# Altium schematic sheet PSU.SchDoc: Power Supply
size A4; CompanyName: TM; DrawnBy: Juan Tinazzo; SheetNumber: 7; SheetTotal: 7; Number: CB_PSU
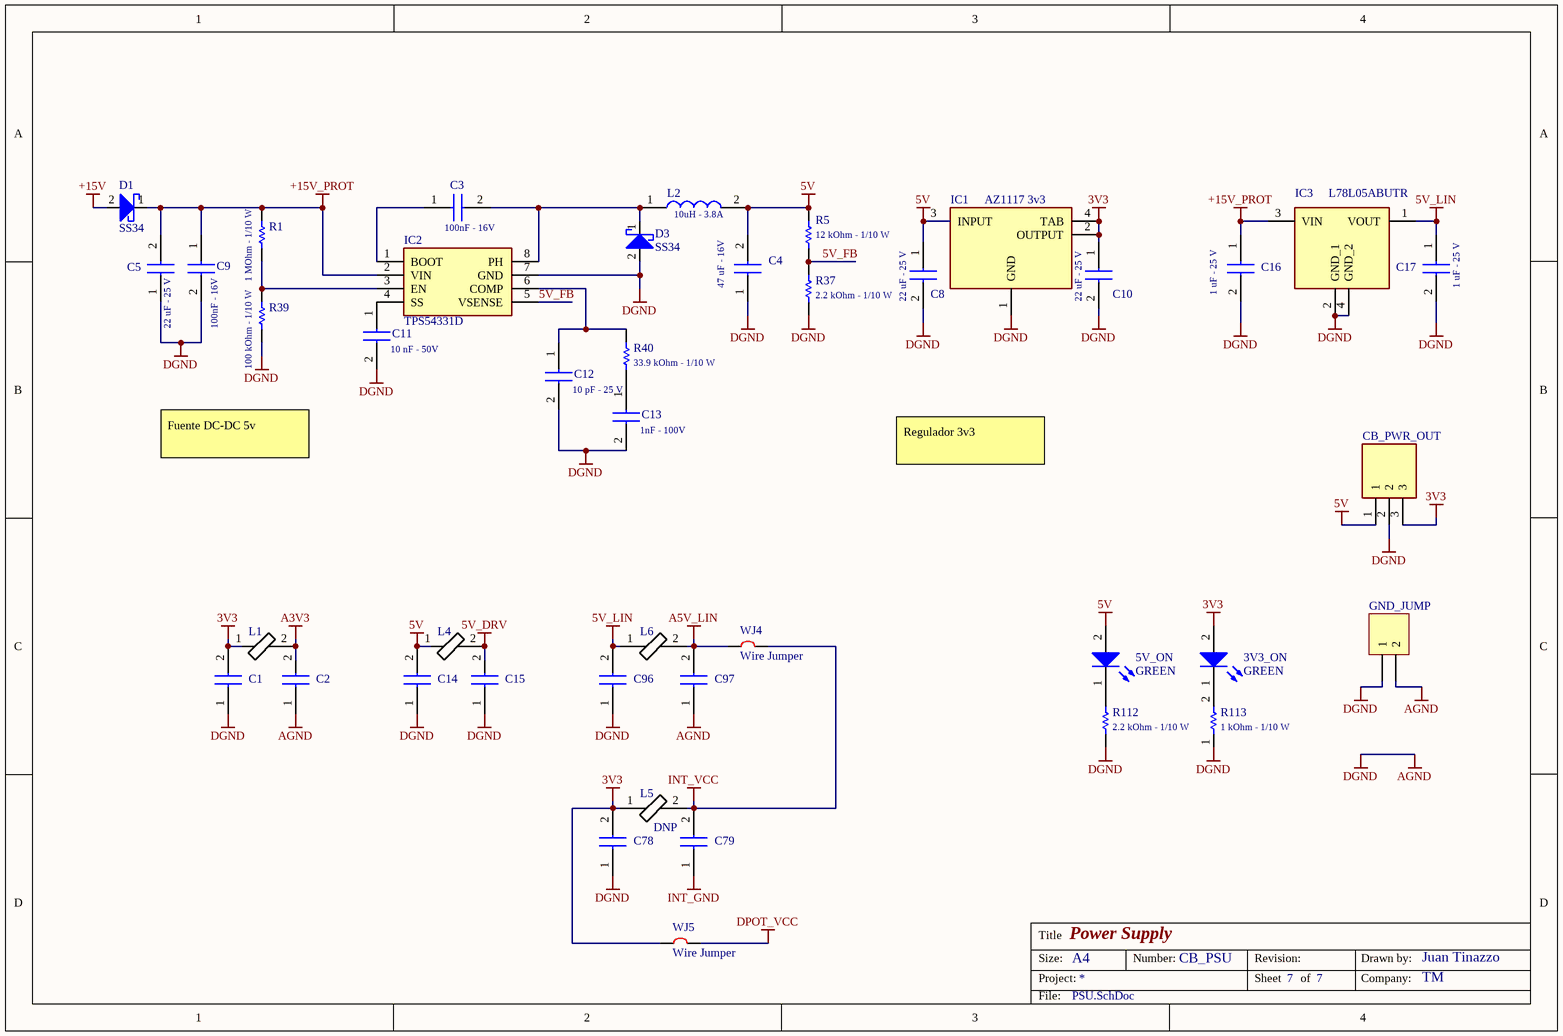
[diagram p0: PSU.SchDoc]

## Parts
3V3_ON  GREEN  [LEDC1608X80N]
5V_ON  GREEN  [LEDC1608X80N]
C1  CL21B105KAFNNNG  [CAPC2012X135N]  (value not drawn)
C2  CL21B105KAFNNNG  [CAPC2012X135N]  (value not drawn)
C3  value 100nF - 16V  [CAPC1608X95N]  (hidden comment: 100n 16V 0603)
C4  value 47 uF - 16V  [CAPC3225X270N]  (hidden comment: GRM32EC81C476KE15K)
C5  value 22 uF - 25 V  [CAPC3216X180N]  (hidden comment: CL31A226KAHNNNE)
C8  value 22 uF - 25 V  [CAPC3216X180N]  (hidden comment: CL31A226KAHNNNE)
C9  value 100nF - 16V  [CAPC1608X95N]  (hidden comment: 100n 16V 0603)
C10  value 22 uF - 25 V  [CAPC3216X180N]  (hidden comment: CL31A226KAHNNNE)
C11  value 10 nF - 50V  [CAPC1608X90N]  (hidden comment: CGA3E2X7R1H103K080AA)
C12  value 10 pF - 25 V  [CAPC1608X87N]  (hidden comment: C0603C100K3GACTU)
C13  value 1nF - 100V  [CAPC1608X90N]  (hidden comment: CGA3E2X7R2A102K080AA)
C14  CL21B105KAFNNNG  [CAPC2012X135N]  (value not drawn)
C15  CL21B105KAFNNNG  [CAPC2012X135N]  (value not drawn)
C16  value 1 uF - 25 V  [CAPC2012X135N]  (hidden comment: 1u)
C17  value 1 uF - 25 V  [CAPC2012X135N]  (hidden comment: 1u)
C78  CL21B105KAFNNNG  [CAPC2012X135N]  (value not drawn)
C79  CL21B105KAFNNNG  [CAPC2012X135N]  (value not drawn)
C96  CL21B105KAFNNNG  [CAPC2012X135N]  (value not drawn)
C97  CL21B105KAFNNNG  [CAPC2012X135N]  (value not drawn)
CB_PWR_OUT  76384-303LF  [76384303LF]  (value not drawn)
D1  SS34  [DIOM7959X262N]
D3  SS34  [DIOM7959X262N]
GND_JUMP  Header 2  [HDR1X2]  (value not drawn)
IC1  AZ1117 3v3  [SOT230P700X180-4N]
IC2  TPS54331D  [SOIC127P600X175-8N]
IC3  L78L05ABUTR  [L78L05ABUTR]
L1  78279220601  [BEADC2012X110N]  (value not drawn)
L2  value 10uH - 3.8A  [CDRH104RNP100NC]  (hidden comment: CDRH104RNP-100NC)
L4  78279220601  [BEADC2012X110N]  (value not drawn)
L5  DNP  [BEADC2012X110N]
L6  78279220601  [BEADC2012X110N]  (value not drawn)
R1  value 1 MOhm - 1/10 W  [RESC1608X50N]  (hidden comment: CRCW06031M00FKEA)
R5  value 12 kOhm - 1/10 W  [RESC1608X50N]  (hidden comment: CRCW060312K0FKEA)
R37  value 2.2 kOhm - 1/10 W  [RESC1608X50N]  (hidden comment: CRCW06032K20FKEA)
R39  value 100 kOhm - 1/10 W  [RESC1608X55N]  (hidden comment: CRCW0603100KFKEAC)
R40  value 33.9 kOhm - 1/10 W  [RESC1608X50N]  (hidden comment: CRCW060339K0FKEA)
R112  value 2.2 kOhm - 1/10 W  [RESC1608X50N]  (hidden comment: CRCW06032K20FKEA)
R113  value 1 kOhm - 1/10 W  [RESC1608X55N]  (hidden comment: CRCW06031K00FKEAC)
WJ4  Wire Jumper  (net tie, no BOM)
WJ5  Wire Jumper  (net tie, no BOM)

## Nets
3V3: 3V3_ON.2(A) C1.2 C10.1 C78.2 CB_PWR_OUT.3 IC1.2(OUTPUT) IC1.4(TAB) L1.1 L5.1 WJ5.0
5V: 5V_ON.2(A) C4.2 C8.1 C14.2 CB_PWR_OUT.1 IC1.3(INPUT) L2.2 L4.1 R5.2
5V_DRV: C15.2 L4.2
5V_LIN: C17.1 C96.2 IC3.1(VOUT) L6.1
+15V: D1.2(A)
+15V_PROT: C5.2 C9.1 C16.1 D1.1(K) IC2.2(VIN) IC3.3(VIN) R1.2
A3V3: C2.2 L1.2
A5V_LIN: C97.2 L6.2 WJ4.0
AGND: C1.1 C2.1 C4.1 C5.1 C8.2 C9.2 C10.2 C11.2 C12.2 C13.2 C14.1 C15.1 C16.2 C17.2 C78.1 C96.1 C97.1 CB_PWR_OUT.2 D3.2(A) GND_JUMP.1 GND_JUMP.2 IC1.1(GND) IC2.7(GND) IC3.2(GND_1) IC3.4(GND_2) R37.1 R39.1 R112.1 R113.1  [also labelled DGND]
DPOT_VCC: WJ5.1
INT_GND: C79.1
INT_VCC: C79.2 L5.2 WJ4.1
5V_FB: IC2.5(VSENSE) R5.1 R37.2
Net3V3_ON_1: 3V3_ON.1(K) R113.2
Net5V_ON_1: 5V_ON.1(K) R112.2
NetC3_1: C3.1 IC2.1(BOOT)
NetC3_2: C3.2 D3.1(K) IC2.8(PH) L2.1
NetC11_1: C11.1 IC2.4(SS)
NetC12_1: C12.1 IC2.6(COMP) R40.2
NetC13_1: C13.1 R40.1
NetIC2_3: IC2.3(EN) R1.1 R39.2

## Notes on the sheet
- Fuente DC-DC 5v
- Regulador 3v3
- Title
- Size:
- Project:
- A4
- Number:
- Revision:
- Sheet
- of
- Drawn by:
- Company:
- File:

## Library data of the parts
3V3_ON 5V_ON = 150060GS75000: LED; Manufacturer_Name: Wurth Elektronik; Value: Led Verde 0603; Datasheet Link: https://componentsearchengine.com/Datasheets/2/150060GS75000.pdf; Height: 0.8mm; Manufacturer_Part_Number: 150060GS75000; Mouser Part Number: 710-150060GS75000; Mouser Price/Stock: https://www.mouser.co.uk/ProductDetail/Wurth-Elektronik/150060GS75000?qs=LlUlMxKIyB0UYkq5lDO8nA%3D%3D
C1 C2 C14 C15 C78 C79 C96 C97 = CL21B105KAFNNNG: Capacitor; Manufacturer_Name: SAMSUNG; Value: 1 uF - 25 V; Datasheet Link: https://datasheet.datasheetarchive.com/originals/distributors/Datasheets-DGA8/2478773.pdf; Height: 1.35mm; Manufacturer_Part_Number: CL21B105KAFNNNG; Mouser Part Number: 187-CL21B105KAFNNNG; Mouser Price/Stock: https://www.mouser.co.uk/ProductDetail/Samsung-Electro-Mechanics/CL21B105KAFNNNG?qs=yOVawPpwOwmXkU%252BG0TK%2F5g%3D%3D; Arrow Part Number: CL21B105KAFNNNG; Arrow Price/Stock: https://www.arrow.com/en/products/cl21b105kafnnng/samsung-electro-mechanics?region=europe
C3 C9 = EMK107B7104KA-T: Capacitor; Manufacturer_Name: TAIYO YUDEN; Datasheet Link: http://www.farnell.com/datasheets/746258.pdf; Height: 0.95mm; Manufacturer_Part_Number: EMK107B7104KA-T; Mouser Part Number: 963-EMK107B7104KA-T; Mouser Price/Stock: https://www.mouser.co.uk/ProductDetail/Taiyo-Yuden/EMK107B7104KA-T?qs=I6KAKw0tg2ybqzX8hKPgfw%3D%3D; Arrow Part Number: EMK107B7104KA-T; Arrow Price/Stock: https://www.arrow.com/en/products/emk107b7104ka-t/taiyo-yuden
C4 = GRM32EC81C476KE15K: Capacitor; Manufacturer_Name: Murata Electronics; Datasheet Link: http://psearch.en.murata.com/capacitor/product/GRM32ER71E226KE15%23.pdf; Height: 2.7mm; Manufacturer_Part_Number: GRM32EC81C476KE15K; Mouser Part Number: 81-GRM32EC81C476KE5K; Mouser Price/Stock: https://www.mouser.co.uk/ProductDetail/Murata-Electronics/GRM32EC81C476KE15K?qs=pba5EUA0Y0ZfNhWUOosFbg%3D%3D; Arrow Part Number: GRM32EC81C476KE15K; Arrow Price/Stock: https://www.arrow.com/en/products/grm32ec81c476ke15k/murata-manufacturing?region=nac
C5 C8 C10 = CL31A226KAHNNNE: Capacitor; Manufacturer_Name: SAMSUNG; Datasheet Link: https://datasheet.datasheetarchive.com/originals/distributors/Datasheets_SAMA/9f57e07966b0fde480de744eca033cf5.pdf; Height: 1.8mm; Manufacturer_Part_Number: CL31A226KAHNNNE; Mouser Part Number: 187-CL31A226KAHNNNE; Mouser Price/Stock: https://www.mouser.co.uk/ProductDetail/Samsung-Electro-Mechanics/CL31A226KAHNNNE?qs=X6jEic%2FHinCdwsjGJII51w%3D%3D; Arrow Part Number: CL31A226KAHNNNE; Arrow Price/Stock: https://www.arrow.com/en/products/cl31a226kahnnne/samsung-electro-mechanics?region=europe
C11 = CGA3E2X7R1H103K080AA: Capacitor; Manufacturer_Name: TDK-Lambda; Datasheet Link: http://docs-europe.electrocomponents.com/webdocs/14e9/0900766b814e9125.pdf; Height: 0.9mm; Manufacturer_Part_Number: CGA3E2X7R1H103K080AA; Mouser Part Number: 810-CGA3E2X7R1H103K; Mouser Price/Stock: https://www.mouser.co.uk/ProductDetail/TDK/CGA3E2X7R1H103K080AA?qs=NRhsANhppD8MREuCb2mQKQ%3D%3D; Arrow Part Number: CGA3E2X7R1H103K080AA; Arrow Price/Stock: https://www.arrow.com/en/products/cga3e2x7r1h103k080aa/tdk?region=nac
C12 = C0603C100K3GACTU: Capacitor; Manufacturer_Name: KEMET; Datasheet Link: https://content.kemet.com/datasheets/KEM_C1003_C0G_SMD.pdf; Height: 0.87mm; Manufacturer_Part_Number: C0603C100K3GACTU; Mouser Part Number: 80-C0603C100K3G; Mouser Price/Stock: https://www.mouser.com/Search/Refine.aspx?Keyword=80-C0603C100K3G; Arrow Part Number: C0603C100K3GACTU; Arrow Price/Stock: https://www.arrow.com/en/products/c0603c100k3gactu/kemet-corporation
C13 = CGA3E2X7R2A102K080AA: Capacitor; Manufacturer_Name: TDK-Lambda; Datasheet Link: http://docs-europe.electrocomponents.com/webdocs/14e9/0900766b814e9125.pdf; Height: 0.9mm; Manufacturer_Part_Number: CGA3E2X7R2A102K080AA; Mouser Part Number: 810-CGA3E2X7R2A102K; Mouser Price/Stock: https://www.mouser.co.uk/ProductDetail/TDK/CGA3E2X7R2A102K080AA?qs=NRhsANhppD%2FkMFCdFnDSsQ%3D%3D; Arrow Part Number: CGA3E2X7R2A102K080AA; Arrow Price/Stock: https://www.arrow.com/en/products/cga3e2x7r2a102k080aa/tdk?region=nac
C16 C17 = CL21B105KAFNNNG: Capacitor; Manufacturer_Name: SAMSUNG; Datasheet Link: https://datasheet.datasheetarchive.com/originals/distributors/Datasheets-DGA8/2478773.pdf; Height: 1.35mm; Manufacturer_Part_Number: CL21B105KAFNNNG; Mouser Part Number: 187-CL21B105KAFNNNG; Mouser Price/Stock: https://www.mouser.co.uk/ProductDetail/Samsung-Electro-Mechanics/CL21B105KAFNNNG?qs=yOVawPpwOwmXkU%252BG0TK%2F5g%3D%3D; Arrow Part Number: CL21B105KAFNNNG; Arrow Price/Stock: https://www.arrow.com/en/products/cl21b105kafnnng/samsung-electro-mechanics?region=europe
CB_PWR_OUT = 76384-303LF: Connector; Manufacturer_Name: Amphenol Communications Solutions; Value: Alojamientos de cables y cabecera 3P VERT; Datasheet Link: https://cdn.amphenol-cs.com/media/wysiwyg/files/drawing/76384.pdf; Height: 9.49mm; Manufacturer_Part_Number: 76384-303LF; Mouser Part Number: 649-76384-303LF; System: Connector
D1 D3 = SS34: Schottky Diode; Manufacturer_Name: Taiwan Semiconductor; Value: 3A - 40V; Datasheet Link: https://componentsearchengine.com/Datasheets/1/SS34.pdf; Height: 2.62mm; Manufacturer_Part_Number: SS34; Mouser Part Number: 821-SS34; Mouser Price/Stock: https://www.mouser.co.uk/ProductDetail/Taiwan-Semiconductor/SS34?qs=JV7lzlMm3yIimVqgKV%2F1SA%3D%3D; Arrow Part Number: SS34; Arrow Price/Stock: https://www.arrow.com/en/products/ss34/taiwan-semiconductor?region=nac
GND_JUMP = Header 2: Header, 2-Pin; Manufacturer_Part_Number: Header 2.54 mm 2P; Value: Clip
IC1 = AZ1117CH-3.3TRG1: Integrated Circuit; Manufacturer_Name: Diodes Inc.; Value: Regulador Lineal 3.3 V; Datasheet Link: https://datasheet.datasheetarchive.com/originals/distributors/Datasheets-DGA25/1776204.pdf; Height: 1.8mm; Manufacturer_Part_Number: AZ1117CH-3.3TRG1; Mouser Part Number: 621-AZ1117CH-3.3TRG1; Mouser Price/Stock: https://www.mouser.co.uk/ProductDetail/Diodes-Incorporated/AZ1117CH-3.3TRG1?qs=FKu9oBikfSm7ntaG6olPSQ%3D%3D; Arrow Part Number: AZ1117CH-3.3TRG1; Arrow Price/Stock: https://www.arrow.com/en/products/az1117ch-3.3trg1/diodes-incorporated?region=nac
IC2 = TPS54331D: Integrated Circuit; Manufacturer_Name: Texas Instruments; Value: Reguladores de voltaje de conmutación 3A 28V In Step Down; Datasheet Link: http://www.ti.com/lit/gpn/tps54331; Height: 1.75mm; Manufacturer_Part_Number: TPS54331D; Mouser Part Number: 595-TPS54331D; Mouser Price/Stock: https://www.mouser.co.uk/ProductDetail/Texas-Instruments/TPS54331D?qs=QyYHynRG50pEbpiybdzwkw%3D%3D; Arrow Part Number: TPS54331D; Arrow Price/Stock: https://www.arrow.com/en/products/tps54331d/texas-instruments?region=nac
IC3 = L78L05ABUTR: Integrated Circuit; Manufacturer_Name: STMicroelectronics; Value: Reguladores de tensión lineal 5.0V 0.1A; Datasheet Link: https://componentsearchengine.com/Datasheets/2/L78L05ABUTR.pdf; Manufacturer_Part_Number: L78L05ABUTR; Mouser Part Number: 511-L78L05ABU; Mouser Price/Stock: https://www.mouser.co.uk/ProductDetail/STMicroelectronics/L78L05ABUTR?qs=1feNxqzJ94QQZYRl%252B78DYA%3D%3D; Arrow Part Number: L78L05ABUTR; Arrow Price/Stock: https://www.arrow.com/en/products/l78l05abutr/stmicroelectronics?region=europe
L1 L4-L6 = 78279220601: Ferrite Bead; Manufacturer_Name: Wurth Elektronik; Value: Núcleos de ferrita WE-MPSA EMI 600Ohms 2.1A 80mOhms; Datasheet Link: https://www.mouser.de/datasheet/2/445/78279220601-2298574.pdf; Height: 1.1mm; Manufacturer_Part_Number: 78279220601; Mouser Part Number: 710-78279220601; Mouser Price/Stock: https://www.mouser.co.uk/ProductDetail/Wurth-Elektronik/78279220601?qs=iLbezkQI%252BsjgiK1FovJqGg%3D%3D
L2 = CDRH104RNP-100NC: Inductor; Manufacturer_Name: Sumida; Datasheet Link: http://products.sumida.com/products/pdf/CDRH104R.pdf; Height: 4mm; Manufacturer_Part_Number: CDRH104RNP-100NC; Mouser Part Number: 851-CDRH104RNP-100NC; Mouser Price/Stock: https://www.mouser.co.uk/ProductDetail/Sumida/CDRH104RNP-100NC?qs=qsxNffVSAzE8lEZlJlwl9Q%3D%3D; Arrow Part Number: CDRH104RNP-100NC; Arrow Price/Stock: https://www.arrow.com/en/products/cdrh104rnp-100nc/sumida?region=nac
R1 = CRCW06031M00FKEA: Resistor; Manufacturer_Name: Vishay; Datasheet Link: http://www.vishay.com/docs/20035/dcrcwe3.pdf; Height: 0.5mm; Manufacturer_Part_Number: CRCW06031M00FKEA; Mouser Part Number: 71-CRCW0603-1.0M-E3; Mouser Price/Stock: https://www.mouser.co.uk/ProductDetail/Vishay-Dale/CRCW06031M00FKEA?qs=FqL7cmfwu%2FFSEaf7V3BJcQ%3D%3D; Arrow Part Number: CRCW06031M00FKEA; Arrow Price/Stock: https://www.arrow.com/en/products/crcw06031m00fkea/vishay?region=nac
R5 = CRCW060312K0FKEA: Resistor; Manufacturer_Name: Vishay; Datasheet Link: http://www.vishay.com/docs/20035/dcrcwe3.pdf; Height: 0.5mm; Manufacturer_Part_Number: CRCW060312K0FKEA; Mouser Part Number: 71-CRCW0603-12K-E3; Mouser Price/Stock: https://www.mouser.co.uk/ProductDetail/Vishay-Dale/CRCW060312K0FKEA?qs=HGDjLH0wsMDt1KMqI4fBYA%3D%3D; Arrow Part Number: CRCW060312K0FKEA; Arrow Price/Stock: https://www.arrow.com/en/products/crcw060312k0fkea/vishay?region=nac
R37 R112 = CRCW06032K20FKEA: Resistor; Manufacturer_Name: Vishay; Datasheet Link: http://www.vishay.com/docs/20035/dcrcwe3.pdf; Height: 0.5mm; Manufacturer_Part_Number: CRCW06032K20FKEA; Mouser Part Number: 71-CRCW0603-2.2K-E3; Mouser Price/Stock: https://www.mouser.co.uk/ProductDetail/Vishay-Dale/CRCW06032K20FKEA?qs=wckIcdUuIXiMEbhHncbunA%3D%3D; Arrow Part Number: CRCW06032K20FKEA; Arrow Price/Stock: https://www.arrow.com/en/products/crcw06032k20fkea/vishay?region=nac
R39 = CRCW0603100KFKEAC: Resistor; Manufacturer_Name: Vishay; Datasheet Link: https://www.mouser.com/datasheet/2/427/crcwce3-1223726.pdf; Height: 0.55mm; Manufacturer_Part_Number: CRCW0603100KFKEAC; Mouser Part Number: 71-CRCW0603100KFKEAC; Mouser Price/Stock: https://www.mouser.co.uk/ProductDetail/Vishay-Dale/CRCW0603100KFKEAC?qs=E3Y5ESvWgWPxzfNYyMgX1w%3D%3D; Arrow Part Number: CRCW0603100KFKEAC; Arrow Price/Stock: https://www.arrow.com/en/products/crcw0603100kfkeac/vishay?region=nac
R40 = CRCW060339K0FKEA: Resistor; Manufacturer_Name: Vishay; Datasheet Link: http://www.vishay.com/docs/20035/dcrcwe3.pdf; Height: 0.5mm; Manufacturer_Part_Number: CRCW060339K0FKEA; Mouser Part Number: 71-CRCW0603-39K-E3; Mouser Price/Stock: https://www.mouser.co.uk/ProductDetail/Vishay-Dale/CRCW060339K0FKEA?qs=LdkvS58n%252BakpUVpOJpUwUw%3D%3D; Arrow Part Number: CRCW060339K0FKEA; Arrow Price/Stock: https://www.arrow.com/en/products/crcw060339k0fkea/vishay
R113 = CRCW06031K00FKEAC: Resistor; Manufacturer_Name: Vishay; Datasheet Link: https://www.vishay.com/docs/28773/crcwce3.pdf; Height: 0.55mm; Manufacturer_Part_Number: CRCW06031K00FKEAC; Mouser Part Number: 71-CRCW06031K00FKEAC; Mouser Price/Stock: https://www.mouser.co.uk/ProductDetail/Vishay-Dale/CRCW06031K00FKEAC?qs=E3Y5ESvWgWOQ7ePIWbGVFg%3D%3D; Arrow Part Number: CRCW06031K00FKEAC; Arrow Price/Stock: https://www.arrow.com/en/products/crcw06031k00fkeac/vishay?region=nac
WJ4 WJ5 = Wire Jumper: Manufacturer_Part_Number: Wire